# Altium project PCB_Project_Dangrangto.PrjPcb
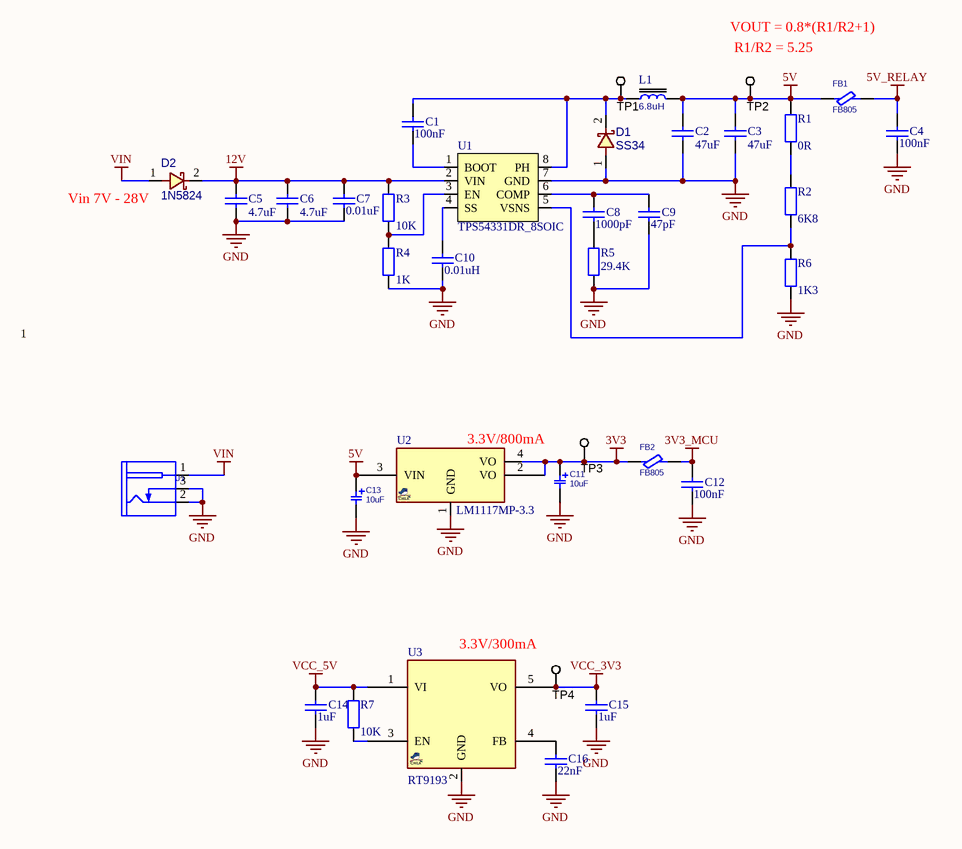
[diagram p0: Power.SchDoc]
5 sheets, 163 parts. Net scope: global (net labels, ports and power ports of the same name join across sheets).
Board file: PCB_Project_Dangrangto.PcbDoc
Sheets:
  Power.SchDoc
  MCU_ESP32_S3.SchDoc
  OUTPUT_RELAY.SchDoc
  SENSOR.SchDoc
  Protocol.SchDoc

## Sheet Power.SchDoc
size A4; SheetNumber: 1; SheetTotal: 5

### Parts
C1  Ma_Hang: 100nF  [tu 0603]  (hidden comment: 100nF_0603_1%)
C2  Ma_Hang: 47uF  [tu 1206]  (hidden comment: 47uF_1206_1%)
C3  Ma_Hang: 47uF  [tu 1206]  (hidden comment: 47uF_1206_1%)
C4  Ma_Hang: 100nF  [tu 0603]  (hidden comment: 100nF_0603_1%)
C5  Ma_Hang: 4.7uF  [tu 1206]  (hidden comment: 4.7uF_1206_1%)
C6  Ma_Hang: 4.7uF  [tu 1206]  (hidden comment: 4.7uF_1206_1%)
C7  Ma_Hang: 0.01uF  [tu 0603]  (hidden comment: 0.01uF_0603_1%)
C8  Ma_Hang: 1000pF  [tu 0603]  (hidden comment: 1000pF_0603_1%)
C9  Ma_Hang: 47pF  [tu 0603]  (hidden comment: 47pF_0603_1%)
C10  Ma_Hang: 0.01uH  [tu 0603]  (hidden comment: 0.01uF_0603_1%)
C11  value 10uF  [C_TN_3216]  (hidden comment: 10uF/6.3V)
C12  Ma_Hang: 100nF  [tu 0603]  (hidden comment: 100nF_0603_1%)
C13  value 10uF  [C_TN_3216]  (hidden comment: 10uF/10V)
C14  Ma_Hang: 1uF  [tu 0603]  (hidden comment: 1uF_0603_1%)
C15  Ma_Hang: 1uF  [tu 0603]  (hidden comment: 1uF_0603_1%)
C16  Ma_Hang: 22nF  [tu 0603]  (hidden comment: 22nF_0603_1%)
D1  value SS34  [D_SMB]  (hidden comment: SS34_SMA)
D2  value 1N5824  [D_SMA]  (hidden comment: SS54_SMA)
FB1  FB805  [L0805]
FB2  FB805  [L0805]
J1  DC_POWER_JACK  [JAC_PWR2]  (value not drawn)
L1  value 6.8uH  [L_10]  (hidden comment: 6.8uH_CD104)
R1  Ma_Hang: 0R  [tro smd 0603]  (hidden comment: 0R_0603_1%)
R2  Ma_Hang: 6K8  [tro smd 0603]  (hidden comment: 6K8_0603_1%)
R3  Ma_Hang: 10K  [tro smd 0603]  (hidden comment: 10K_0603_1%)
R4  Ma_Hang: 1K  [tro smd 0603]  (hidden comment: 1K_0603_1%)
R5  Ma_Hang: 29.4K  [tro smd 0805]  (hidden comment: 29.4K_0805_1%)
R6  Ma_Hang: 1K3  [tro smd 0603]  (hidden comment: 1K3_0603_1%)
R7  Ma_Hang: 10K  [tro smd 0603]  (hidden comment: 10K_0603_1%)
TP1  TESTPOINT_PROBE  [TEST_POINT_1.0X1.0MM]  (value not drawn)  (no BOM)
TP2  TESTPOINT_PROBE  [TEST_POINT_1.0X1.0MM]  (value not drawn)  (no BOM)
TP3  TESTPOINT_PROBE  [TEST_POINT_1.0X1.0MM]  (value not drawn)  (no BOM)
TP4  TESTPOINT_PROBE  [TEST_POINT_1.0X1.0MM]  (value not drawn)  (no BOM)
U1  TPS54331DR_8SOIC  [SOIC-8N]
U2  value LM1117MP-3.3  [SOT223_4]  (hidden comment: LM1117IMP-3.3/NOPB)
U3  RT9193  [SOT23_5]

### Nets
3V3: C11.1 FB2.1 TP3.1 U2.2(VO) U2.4(VO)
3V3_MCU: C12.1 FB2.2
5V: C2.1 C3.1 C13.1 FB1.1 L1.2 R1.2 TP2.1 U2.3(VIN)
5V_RELAY: C4.1 FB1.2
12V: C5.1 C6.1 C7.1 D2.2 R3.2 U1.2(VIN)
GND: C2.2 C3.2 C4.2 C5.2 C6.2 C7.2 C9.2 C10.2 C11.2 C12.2 C13.2 C14.2 C15.2 C16.2 D1.1 J1.2(SLEEVE) J1.3(INSERTION_DET) R4.1 R5.1 R6.1 U1.7(GND) U2.1(GND) U3.2(GND)
VCC_3V3: C15.1 TP4.1 U3.5(VO)
VCC_5V: C14.1 R7.2 U3.1(VI)
VIN: D2.1 J1.1(TIP)
NetC1_1: C1.1 D1.2 L1.1 TP1.1 U1.8(PH)
NetC1_2: C1.2 U1.1(BOOT)
NetC8_1: C8.1 C9.1 U1.6(COMP)
NetC8_2: C8.2 R5.2
NetC10_1: C10.1 U1.4(SS)
NetC16_1: C16.1 U3.4(FB)
NetR1_1: R1.1 R2.2
NetR2_1: R2.1 R6.2 U1.5(VSNS)
NetR3_1: R3.1 R4.2 U1.3(EN)
NetR7_1: R7.1 U3.3(EN)

### Notes on the sheet
- VOUT = 0.8*(R1/R2+1)
- R1/R2 = 5.25
- (near D2) Vin 7V - 28V
- 1
- (near U2) 3.3V/800mA
- 3.3V/300mA

### Library data of the parts
C1 C4 C7-C9 C12 C14-C16 = Tu 0603 470pF 50V 10%: Capacitor, Ceramic, 50V; Chung_Loai: Dán; Don_Vi: Con; So_Chan: 2; Ten_Linh_Kien: Tụ 0603 470P 50V 10%; Kieu_Chan: *
C2 C3 C5 C6 = Tu 1206 103 50V 10%: Capacitor, Ceramic, 50V; Chung_Loai: Dán; Don_Vi: Con; So_Chan: 2; Ten_Linh_Kien: Tụ 1206 103-10nF 10% 50V; Kieu_Chan: *
C10 = Tu 0603 470pF 50V 10%: CAP SMD 0603; Chung_Loai: Dán; Don_Vi: Con; So_Chan: 2; Ten_Linh_Kien: Tụ 0603 470P 50V 10%; Kieu_Chan: *
C11 = CAP_SMD_TAN_10uF_6.3V: CAP, SMD, TAN; PARAM: 20%, 300mOhm, -55~105oC; MANF: VISHAY; MANF_P#: T55A106M6R3C0300; PARAM2: 6.3V; PRICE: 0.46$
C13 = CAP_SMD_TAN_10uF_10V: CAP, SMD, TAN; PARAM: 20%, 300mOhm, -55~105oC; MANF: VISHAY; MANF_P#: T55A106M010C0300; PARAM2: 10V; PRICE: 0.46$
D1 = DIODE_SMD_SCHOTTKY_SS34: DIODE, SCHOTTKY, 20V, 3A; MANF: VISHAY; DESC: DESCRIPTION; MANF_P#: SS34; ASSEMBLY: ASSEMBLY; PRICE: PRICE; PARAM2: 3A; PARAM: 20V
D2 = DIODE_SMD_SCHOTTKY_1N5822: DIODE, SCHOTTKY, 40V, 3A; MANF: DIODES; MANF_P#: 1N5822; DESC: DESCRIPTION; ASSEMBLY: ASSEMBLY; PRICE: PRICE; PARAM2: 3A; PARAM: 40V
FB1 FB2 = FBEAD_SMD_BLM21PG221: FERRITE_Bead, 0805, 2A, 50mOhm, 220@100MHz; MANF: MURATA; MANF_P#: BLM15AG121SN1D; PARAM: 220@100MHz; PARAM2: 2A, 50mOhm; VALUE: FB805
J1 = CONN_PWR_JACKR2: CONN, PWR JACK DC, PLUG DIAM 2.0MM RA THD; MANF: CUI STACK; MANF_P#: PJ-202A, PJ-002AH, PJ-102AH, KLDX-0202; VALUE: DC_POWER_JACK
L1 = INDPWR_SMD: INDUCTOR, POWER, SMD
R1-R4 R6 R7 = Tro 0603 5% 10k: RES SMD 0603; Chung_Loai: Dán; Don_Vi: Con; So_Chan: 2; Ten_Linh_Kien: Trở 0603 5% 10k; Kieu_Chan: *
R5 = Tro 0805 1% 5.1k: Dán; Don_Vi: Con; So_Chan: 2; Ten_Linh_Kien: Trở 0805 1% 5.1k; Chung_Loai: Dán; Kieu_Chan: *
TP1-TP4 = TESTPOINT_PROBE: TEST POINT; MANF: MANF; MANF_P#: MANF_P#; VALUE: VALUE
U1 = TPS54331DR: IC REG BUCK ADJ 3A 8SOIC
U2 = VREG_1117_SOT223: REG, Linear, LDO1V, 0.8A, SOT-223; MANF_P#: LD1117, LM1117, AMS1117, TLV1117, REG1117, NCP1117, LT1117, SPX1117; MANF: TI, ON, ST; PARAM2: 1.2/1.5/1.8/2.5/2.85/3.3/5V; PARAM: LDO1V, 0.8A
U3 = VREG_LDO_SOT23_5: REG, Linear, LDO, SOT-23-5; MANF_P#: AS1353, MIC5504YM5, MCP1824T-3302E/OT, ADP122AUJZ, TLV70233DBVR, LDK130M33R, NCP603SN, AP2210K, AP7331, AP2125K, RP114N; MANF: -; VALUE: RT9193

## Sheet MCU_ESP32_S3.SchDoc
size A4; SheetNumber: 2; SheetTotal: 5
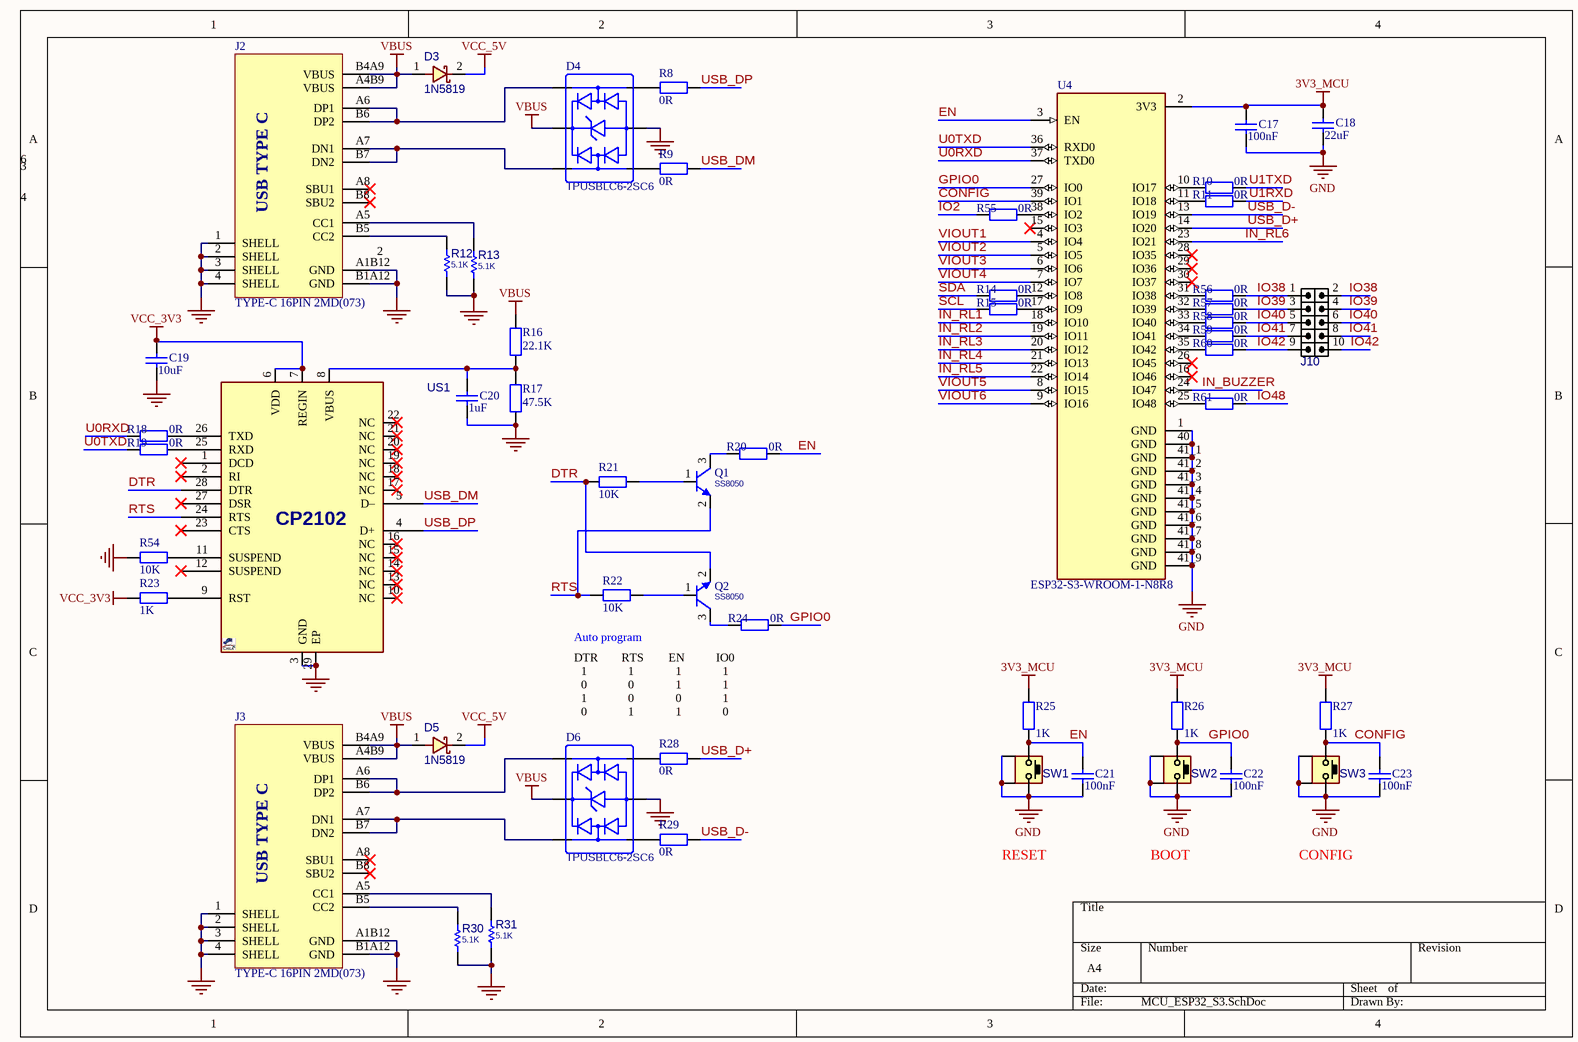
[diagram p1: MCU_ESP32_S3.SchDoc]

### Parts
C17  Ma_Hang: 100nF  [tu 0603]  (hidden comment: 100nF_0603_1%)
C18  Ma_Hang: 22uF  [tu 0603]  (hidden comment: 22uF_0603_1%)
C19  Ma_Hang: 10uF  [tu 0603]  (hidden comment: 10uF_0603_1%)
C20  Ma_Hang: 1uF  [tu 0603]  (hidden comment: 1uF_0603_1%)
C21  Ma_Hang: 100nF  [tu 0603]  (hidden comment: 100nF_0603_1%)
C22  Ma_Hang: 100nF  [tu 0603]  (hidden comment: 100nF_0603_1%)
C23  Ma_Hang: 100nF  [tu 0603]  (hidden comment: 100nF_0603_1%)
D3  value 1N5819  [D_SOD123W]  (hidden comment: 1N5819_DO213)
D4  TPUSBLC6-2SC6  [SOT-23-6_L2.9-W1.6-P0.95-LS2.8-BR]
D5  value 1N5819  [D_SOD123W]  (hidden comment: 1N5819_DO213)
D6  TPUSBLC6-2SC6  [SOT-23-6_L2.9-W1.6-P0.95-LS2.8-BR]
J2  TYPE-C 16PIN 2MD(073)  [USB-C-SMD_TYPE-C16PIN]
J3  TYPE-C 16PIN 2MD(073)  [USB-C-SMD_TYPE-C16PIN]
J10  HDRMINI_2X5  [HDRMINI_M_2X5]  (value not drawn)
Q1  SS8050  [SOT23_3]
Q2  SS8050  [SOT23_3]
R8  Ma_Hang: 0R  [tro smd 0603]  (hidden comment: 0R_0603_1%)
R9  Ma_Hang: 0R  [tro smd 0603]  (hidden comment: 0R_0603_1%)
R10  Ma_Hang: 0R  [tro smd 0603]  (hidden comment: 0R_0603_1%)
R11  Ma_Hang: 0R  [tro smd 0603]  (hidden comment: 0R_0603_1%)
R12  value 5.1K  [R0603]  (hidden comment: 5K1_0603_1%)
R13  value 5.1K  [R0603]  (hidden comment: 5K1_0603_1%)
R14  Ma_Hang: 0R  [tro smd 0603]  (hidden comment: 0R_0603_1%)
R15  Ma_Hang: 0R  [tro smd 0603]  (hidden comment: 0R_0603_1%)
R16  Ma_Hang: 22.1K  [tro smd 0603]  (hidden comment: 22.1K_0603_1%)
R17  Ma_Hang: 47.5K  [tro smd 0603]  (hidden comment: 47.5K_0603_1%)
R18  Ma_Hang: 0R  [tro smd 0603]  (hidden comment: 0R_0603_1%)
R19  Ma_Hang: 0R  [tro smd 0603]  (hidden comment: 0R_0603_1%)
R20  Ma_Hang: 0R  [tro smd 0603]  (hidden comment: 0R_0603_1%)
R21  Ma_Hang: 10K  [tro smd 0603]  (hidden comment: 10K_0603_1%)
R22  Ma_Hang: 10K  [tro smd 0603]  (hidden comment: 10K_0603_1%)
R23  Ma_Hang: 1K  [tro smd 0603]  (hidden comment: 1K_0603_1%)
R24  Ma_Hang: 0R  [tro smd 0603]  (hidden comment: 0R_0603_1%)
R25  Ma_Hang: 1K  [tro smd 0603]  (hidden comment: 1K_0603_1%)
R26  Ma_Hang: 1K  [tro smd 0603]  (hidden comment: 1K_0603_1%)
R27  Ma_Hang: 1K  [tro smd 0603]  (hidden comment: 1K_0603_1%)
R28  Ma_Hang: 0R  [tro smd 0603]  (hidden comment: 0R_0603_1%)
R29  Ma_Hang: 0R  [tro smd 0603]  (hidden comment: 0R_0603_1%)
R30  value 5.1K  [R0603]  (hidden comment: 5K1_0603_1%)
R31  value 5.1K  [R0603]  (hidden comment: 5K1_0603_1%)
R54  Ma_Hang: 10K  [tro smd 0603]  (hidden comment: 10K_0603_1%)
R55  Ma_Hang: 0R  [tro smd 0603]  (hidden comment: 0R_0603_1%)
R56  Ma_Hang: 0R  [tro smd 0603]  (hidden comment: 0R_0603_1%)
R57  Ma_Hang: 0R  [tro smd 0603]  (hidden comment: 0R_0603_1%)
R58  Ma_Hang: 0R  [tro smd 0603]  (hidden comment: 0R_0603_1%)
R59  Ma_Hang: 0R  [tro smd 0603]  (hidden comment: 0R_0603_1%)
R60  Ma_Hang: 0R  [tro smd 0603]  (hidden comment: 0R_0603_1%)
R61  Ma_Hang: 0R  [tro smd 0603]  (hidden comment: 0R_0603_1%)
SW1  PUSHBUTTON  [SWPBT_SPST_R_6X6X10]  (value not drawn)
SW2  PUSHBUTTON  [SWPBT_SPST_R_6X6X10]  (value not drawn)
SW3  PUSHBUTTON  [SWPBT_SPST_R_6X6X10]  (value not drawn)
U4  ESP32-S3-WROOM-1-N8R8  [XCVR_ESP32S3WROOM1N8R8]
US1  CP2102_QFN28  [QFN50_28T]  (value not drawn)

### Nets
3V3_MCU: C17.1 C18.1 R25.2 R26.2 R27.2 U4.2(3V3)
GND: C17.2 C18.2 C19.2 C20.2 C21.2 C22.2 C23.2 D4.2(GND) D6.2(GND) J2.1(SHELL) J2.2(SHELL) J2.3(SHELL) J2.4(SHELL) J2.A1B12(GND) J2.B1A12(GND) J3.1(SHELL) J3.2(SHELL) J3.3(SHELL) J3.4(SHELL) J3.A1B12(GND) J3.B1A12(GND) R12.2 R13.2 R17.2 R30.2 R31.2 R54.2 SW1.2 SW1.MH1 SW1.MH2 SW2.2 SW2.MH1 SW2.MH2 SW3.2 SW3.MH1 SW3.MH2 U4.1(GND) U4.40(GND) U4.41_1(GND) U4.41_2(GND) U4.41_3(GND) U4.41_4(GND) U4.41_5(GND) U4.41_6(GND) U4.41_7(GND) U4.41_8(GND) U4.41_9(GND) US1.3(GND) US1.29(EP)
VBUS: D3.1 D4.5(VBUS) D5.1 D6.5(VBUS) J2.A4B9(VBUS) J2.B4A9(VBUS) J3.A4B9(VBUS) J3.B4A9(VBUS) R16.1
VCC_3V3: C19.1 R23.1 US1.6(VDD) US1.7(REGIN)
VCC_5V: D3.2 D5.2
CONFIG: C23.1 R27.1 SW3.1 U4.39(IO1)
DTR: Q2.2(E) R21.2 US1.28(DTR)
EN: C21.1 R20.2 R25.1 SW1.1 U4.3(EN)
GPIO0: C22.1 R24.2 R26.1 SW2.1 U4.27(IO0)
IN_BUZZER: U4.24(IO47)
IN_RL1: U4.18(IO10)
IN_RL2: U4.19(IO11)
IN_RL3: U4.20(IO12)
IN_RL4: U4.21(IO13)
IN_RL5: U4.22(IO14)
IN_RL6: U4.23(IO21)
IO2: R55.1
IO38: J10.1 J10.2 R56.2
IO39: J10.3 J10.4 R57.2
IO40: J10.5 J10.6 R58.2
IO41: J10.7 J10.8 R59.2
IO42: J10.9 J10.10 R60.2
IO48: R61.2
RTS: Q1.2(E) R22.2 US1.24(RTS)
SCL: R15.1
SDA: R14.1
U0RXD: R18.1 U4.37(TXD0)
U0TXD: R19.1 U4.36(RXD0)
U1RXD: R11.2
U1TXD: R10.2
USB_D+: R28.2 U4.14(IO20)
USB_D-: R29.2 U4.13(IO19)
USB_DM: R9.2 US1.5(D–)
USB_DP: R8.2 US1.4(D+)
VIOUT1: U4.4(IO4)
VIOUT2: U4.5(IO5)
VIOUT3: U4.6(IO6)
VIOUT4: U4.7(IO7)
VIOUT5: U4.8(IO15)
VIOUT6: U4.9(IO16)
NetC20_1: C20.1 R16.2 R17.1 US1.8(VBUS)
NetD4_1: D4.1(I/O1) R8.1
NetD4_3: D4.3(I/O2) R9.1
NetD4_4: D4.4(I/O2) J2.A7(DN1) J2.B7(DN2)
NetD4_6: D4.6(I/O1) J2.A6(DP1) J2.B6(DP2)
NetD6_1: D6.1(I/O1) R28.1
NetD6_3: D6.3(I/O2) R29.1
NetD6_4: D6.4(I/O2) J3.A7(DN1) J3.B7(DN2)
NetD6_6: D6.6(I/O1) J3.A6(DP1) J3.B6(DP2)
NetJ2_A5: J2.A5(CC1) R13.1
NetJ2_B5: J2.B5(CC2) R12.1
NetJ3_A5: J3.A5(CC1) R31.1
NetJ3_B5: J3.B5(CC2) R30.1
NetQ1_1: Q1.1(B) R21.1
NetQ1_3: Q1.3(C) R20.1
NetQ2_1: Q2.1(B) R22.1
NetQ2_3: Q2.3(C) R24.1
NetR10_1: R10.1 U4.10(IO17)
NetR11_1: R11.1 U4.11(IO18)
NetR14_2: R14.2 U4.12(IO8)
NetR15_2: R15.2 U4.17(IO9)
NetR18_2: R18.2 US1.26(TXD)
NetR19_2: R19.2 US1.25(RXD)
NetR23_2: R23.2 US1.9(RST)
NetR54_1: R54.1 US1.11(SUSPEND)
NetR55_2: R55.2 U4.38(IO2)
NetR56_1: R56.1 U4.31(IO38)
NetR57_1: R57.1 U4.32(IO39)
NetR58_1: R58.1 U4.33(IO40)
NetR59_1: R59.1 U4.34(IO41)
NetR60_1: R60.1 U4.35(IO42)
NetR61_1: R61.1 U4.25(IO48)

Not connected (* = marked no-connect by the designer): J2 A8(SBU1)* B8(SBU2)*; J3 A8(SBU1)* B8(SBU2)*; U4 15(IO3)* 16(IO46)* 26(IO45)* 28(IO35)* 29(IO36)* 30(IO37)*; US1 1(DCD)* 2(RI)* 10(NC)* 12(SUSPEND)* 13(NC)* 14(NC)* 15(NC)* 16(NC)* 17(NC)* 18(NC)* 19(NC)* 20(NC)* 21(NC)* 22(NC)* 23(CTS)* 27(DSR)*

### Notes on the sheet
- 3
- 6
- 4
- (near J2) 2
- Auto program
- DTR
- RTS
- EN
- IO0
- 1
- 0
- (near D6) 1
- (near D6) 0
- RESET
- BOOT
- CONFIG
- (in symbol TYPE-C 16PIN 2MD(073)) USB TYPE C

### Library data of the parts
C17-C23 = Tu 0603 470pF 50V 10%: as C1 on sheet Power; Kieu_Chan: *
D3 D5 = DIODE_SMD_SCHOTTKY_1N5819: DIODE, SCHOTTKY, 40V, 1A; MANF: DIODES; MANF_P#: 1N5819HW-7-F; DESC: DESCRIPTION; ASSEMBLY: ASSEMBLY; PRICE: PRICE; PARAM2: 1A; PARAM: 40V
D4 D6 = ESD_TPUSBLC6-2SC6: ESD ROHS SOT23-6 DIODES; Manufacturer: TECH PUBLIC; LCSC Part Number: C558442; Manufacturer Part Number: TPUSBLC6-2SC6; Package: SOT-23-6; Assembly Type: SMT Assembly
J2 J3 = TYPE-C 16PIN 2MD(073): 5A 1 Surface Mount 16 Female -25℃~+85℃ Type-C SMD USB Connectors ROHS; Manufacturer: SHOU HAN; Manufacturer Part Number: TYPE-C16PIN; LCSC Part Number: C2765186; Package: SMD; Assembly Type: SMT Assembly
J10 = HDRMINI_M_2X5: CONN, HEADER, Male, pitch: 1.27mm, 10POS; VALUE: HDRMINI_2X5
Q1 Q2 = NPN_MMBT8050_SOT23: BJT, NPN, 25v, 1.5A, SMD, SOT23; PARAM2: 300mW; MANF: GALAXY; PARAM: 25v, 1.5A; MANF_P#: MMBT8050; PRICE: 0.09t@JAVAN; VALUE: SS8050
R8-R11 R14-R29 R54-R61 = Tro 0603 5% 10k: as R1 on sheet Power; Kieu_Chan: *
R12 R13 R30 R31 = RES_SMD_0603: RESISTOR, SMD; PARAM: -W; DESC: DESCRIPTION; DIST#: MOUSER; PARAM2: 1%; MANF_P#: -; MANF: -; ASSEMBLY: ASSEMBLY; PRICE: 100= 0.5$
SW1-SW3 = SWPBT_SPST_R_6X6X10: SWITCH, PUSH BUTTON, TACTILE, THD, SPST, RIGHT; PARAM: 50mA/12VDC; DESC: DESCRIPTION; MANF: -; VALUE: PUSHBUTTON; ASSEMBLY: ASSEMBLY; PRICE: 0.3$; MANF_P#: -
U4 = ESP32-S3-WROOM-1-N8R8: Bluetooth, WiFi 802.11b/g/n, Bluetooth v5.0 Transceiver Module 2.4GHz PCB Trace Surface Mount; MF: Espressif Systems; Package: None; Price: None; Check_prices: https://www.snapeda.com/parts/ESP32-S3-WROOM-1-N8R8/Espressif+Systems/view-part/?ref=eda; Value: *; SnapEDA_Link: https://www.snapeda.com/parts/ESP32-S3-WROOM-1-N8R8/Espressif+Systems/view-part/?ref=snap; MP: ESP32-S3-WROOM-1-N8R8; Availability: In Stock; Purchase-URL: https://pricing.snapeda.com/search?q=ESP32-S3-WROOM-1-N8R8&ref=eda
US1 = CP2102_QFN28: USB-UART BRIDGE; MANF: SILICON LABS; DESC: DESCRIPTION; MANF_P#: CP2102; PARAM2: 3.3V; VALUE: CP2102; MANF: MANF; ASSEMBLY: ASSEMBLY; PRICE: PRICE

## Sheet OUTPUT_RELAY.SchDoc
size A4; SheetNumber: 3; SheetTotal: 5
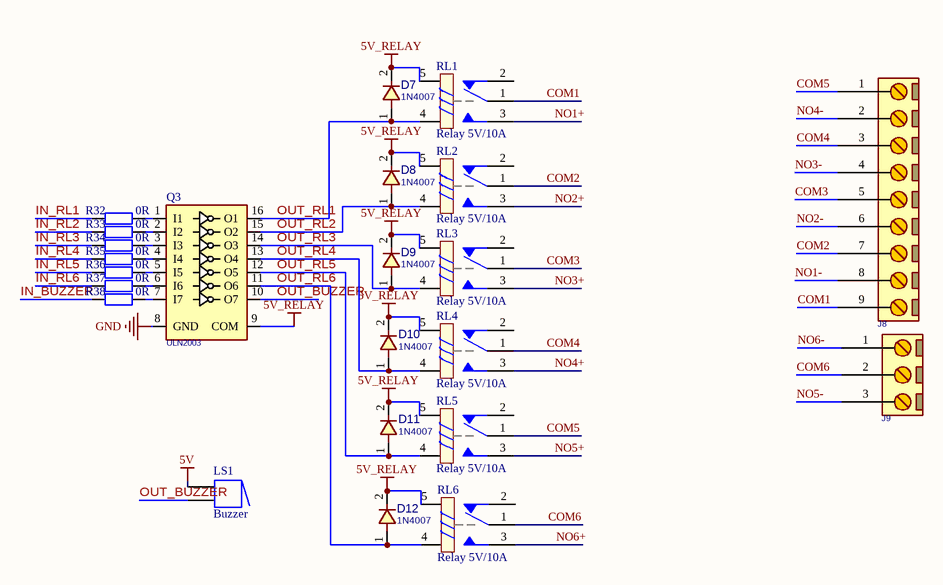
[diagram p2: OUTPUT_RELAY.SchDoc]

### Parts
D7  1N4007  [D_SMA]
D8  1N4007  [D_SMA]
D9  1N4007  [D_SMA]
D10  1N4007  [D_SMA]
D11  1N4007  [D_SMA]
D12  1N4007  [D_SMA]
J8  CONN_TB9  [TBB_9]  (value not drawn)
J9  CONN_TB3  [TBB_3]  (value not drawn)
LS1  Buzzer  [Buzzer]
Q3  value ULN2003  [SO_16_W]  (hidden comment: ULN2003_SOP16)
R32  Ma_Hang: 0R  [tro smd 0603]  (hidden comment: 0R_0603_1%)
R33  Ma_Hang: 0R  [tro smd 0603]  (hidden comment: 0R_0603_1%)
R34  Ma_Hang: 0R  [tro smd 0603]  (hidden comment: 0R_0603_1%)
R35  Ma_Hang: 0R  [tro smd 0603]  (hidden comment: 0R_0603_1%)
R36  Ma_Hang: 0R  [tro smd 0603]  (hidden comment: 0R_0603_1%)
R37  Ma_Hang: 0R  [tro smd 0603]  (hidden comment: 0R_0603_1%)
R38  Ma_Hang: 0R  [tro smd 0603]  (hidden comment: 0R_0603_1%)
RL1  Relay 5V/10A  [RL_10A_5V]
RL2  Relay 5V/10A  [RL_10A_5V]
RL3  Relay 5V/10A  [RL_10A_5V]
RL4  Relay 5V/10A  [RL_10A_5V]
RL5  Relay 5V/10A  [RL_10A_5V]
RL6  Relay 5V/10A  [RL_10A_5V]

### Nets
5V: LS1.1
5V_RELAY: D7.2 D8.2 D9.2 D10.2 D11.2 D12.2 Q3.9(COM) RL1.5 RL2.5 RL3.5 RL4.5 RL5.5 RL6.5
GND: Q3.8(GND)
COM1: J8.9 RL1.1
COM2: J8.7 RL2.1
COM3: J8.5 RL3.1
COM4: J8.3 RL4.1
COM5: J8.1 RL5.1
COM6: J9.2 RL6.1
IN_BUZZER: R38.2
IN_RL1: R32.2
IN_RL2: R33.2
IN_RL3: R34.2
IN_RL4: R35.2
IN_RL5: R36.2
IN_RL6: R37.2
NO1+: RL1.3
NO1-: J8.8
NO2+: RL2.3
NO2-: J8.6
NO3+: RL3.3
NO3-: J8.4
NO4+: RL4.3
NO4-: J8.2
NO5+: RL5.3
NO5-: J9.3
NO6+: RL6.3
NO6-: J9.1
OUT_BUZZER: LS1.2 Q3.10(O7)
OUT_RL1: D7.1 Q3.16(O1) RL1.4
OUT_RL2: D8.1 Q3.15(O2) RL2.4
OUT_RL3: D9.1 Q3.14(O3) RL3.4
OUT_RL4: D10.1 Q3.13(O4) RL4.4
OUT_RL5: D11.1 Q3.12(O5) RL5.4
OUT_RL6: D12.1 Q3.11(O6) RL6.4
NetQ3_1: Q3.1(I1) R32.1
NetQ3_2: Q3.2(I2) R33.1
NetQ3_3: Q3.3(I3) R34.1
NetQ3_4: Q3.4(I4) R35.1
NetQ3_5: Q3.5(I5) R36.1
NetQ3_6: Q3.6(I6) R37.1
NetQ3_7: Q3.7(I7) R38.1

Not connected (* = marked no-connect by the designer): RL1 2; RL2 2; RL3 2; RL4 2; RL5 2; RL6 2

### Library data of the parts
D7-D12 = DIODE_SMD_1N4007: DIODE, GENERAL PURPOSE, 1000V/1A; MANF: Kingtronics; DESC: DESCRIPTION; PARAM: 1000V VRRM; PARAM2: 1A; MANF_P#: M7; ASSEMBLY: ASSEMBLY; PRICE: PRICE; VALUE: 1N4007
J8 = CONN_TB9: CONN, TERMINAL BLOCK, 5.08mm pitch; VALUE: CONN_TB9
J9 = CONN_TB3: CONN, TERMINAL BLOCK, 5.08mm pitch; VALUE: CONN_TB3
LS1 = Buzzer: Magnetic Transducer Buzzer; Published: 24-Mar-1999; LatestRevisionDate: 17-Dec-2003; LatestRevisionNote: Schematic revised, PCB Footprint replaced.; DatasheetDocument: 17-Dec-2003; PackageReference: ABSM-1574; Publisher: Altium Limited; ComponentLink1Description: Manufacturer Link; ComponentLink1URL: http://www.megastar.com/linecard/buzzmode/index.php
Q3 = ULN2003_SOP16: Darlington, 7-CH, 50V, 0.5A; MANF_P#: ULN2003A; MANF: DIODES; PARAM: 7-CH, 50V, 0.5A; PARAM2: -
R32-R38 = Tro 0603 5% 10k: as R1 on sheet Power; Kieu_Chan: *
RL1-RL6 = Relay 5V10A: Relay SPDT,10A - 12VDC 5 Pin; Value: Relay SPDT, 10A, 12V

## Sheet SENSOR.SchDoc
size A4; SheetNumber: 4; SheetTotal: 5
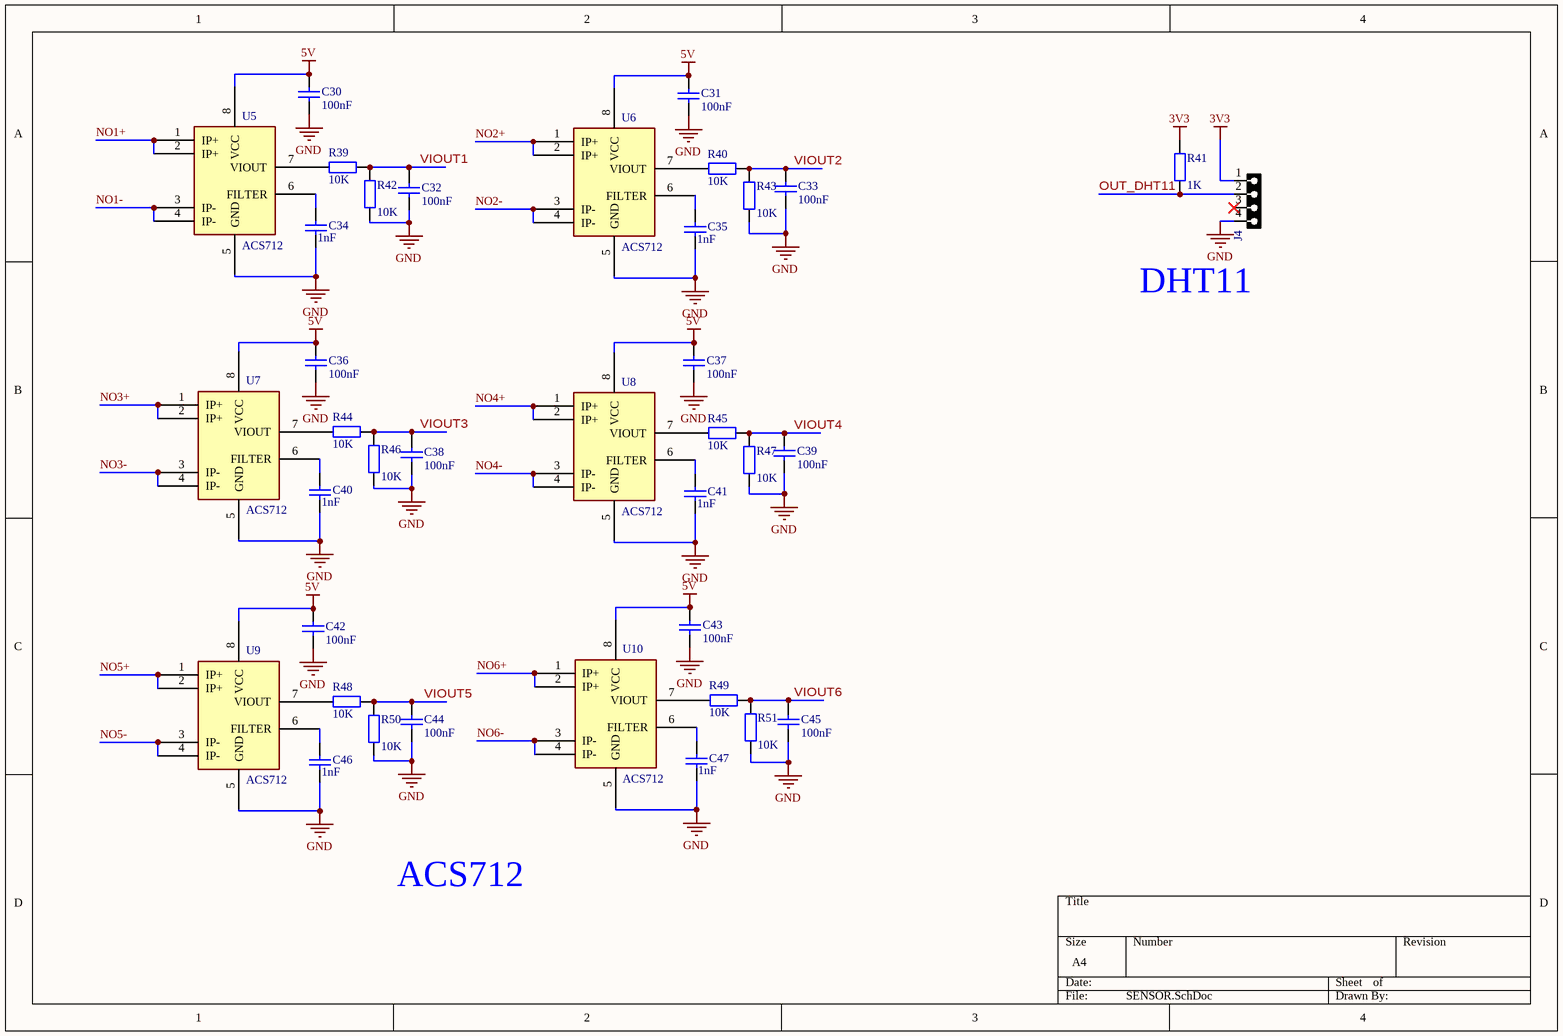
[diagram p3: SENSOR.SchDoc]

### Parts
C30  Ma_Hang: 100nF  [tu 0603]  (hidden comment: 100nF_0603_1%)
C31  Ma_Hang: 100nF  [tu 0603]  (hidden comment: 100nF_0603_1%)
C32  Ma_Hang: 100nF  [tu 0603]  (hidden comment: 100nF_0603_1%)
C33  Ma_Hang: 100nF  [tu 0603]  (hidden comment: 100nF_0603_1%)
C34  Ma_Hang: 1nF  [tu 0603]  (hidden comment: 1nF_0603_1%)
C35  Ma_Hang: 1nF  [tu 0603]  (hidden comment: 1nF_0603_1%)
C36  Ma_Hang: 100nF  [tu 0603]  (hidden comment: 100nF_0603_1%)
C37  Ma_Hang: 100nF  [tu 0603]  (hidden comment: 100nF_0603_1%)
C38  Ma_Hang: 100nF  [tu 0603]  (hidden comment: 100nF_0603_1%)
C39  Ma_Hang: 100nF  [tu 0603]  (hidden comment: 100nF_0603_1%)
C40  Ma_Hang: 1nF  [tu 0603]  (hidden comment: 1nF_0603_1%)
C41  Ma_Hang: 1nF  [tu 0603]  (hidden comment: 1nF_0603_1%)
C42  Ma_Hang: 100nF  [tu 0603]  (hidden comment: 100nF_0603_1%)
C43  Ma_Hang: 100nF  [tu 0603]  (hidden comment: 100nF_0603_1%)
C44  Ma_Hang: 100nF  [tu 0603]  (hidden comment: 100nF_0603_1%)
C45  Ma_Hang: 100nF  [tu 0603]  (hidden comment: 100nF_0603_1%)
C46  Ma_Hang: 1nF  [tu 0603]  (hidden comment: 1nF_0603_1%)
C47  Ma_Hang: 1nF  [tu 0603]  (hidden comment: 1nF_0603_1%)
J4  HDRF4  [HDR_F_1X4]  (value not drawn)
R39  Ma_Hang: 10K  [tro smd 0603]  (hidden comment: 10K_0603_1%)
R40  Ma_Hang: 10K  [tro smd 0603]  (hidden comment: 10K_0603_1%)
R41  Ma_Hang: 1K  [tro smd 0603]  (hidden comment: 1K_0603_1%)
R42  Ma_Hang: 10K  [tro smd 0603]  (hidden comment: 10K_0603_1%)
R43  Ma_Hang: 10K  [tro smd 0603]  (hidden comment: 10K_0603_1%)
R44  Ma_Hang: 10K  [tro smd 0603]  (hidden comment: 10K_0603_1%)
R45  Ma_Hang: 10K  [tro smd 0603]  (hidden comment: 10K_0603_1%)
R46  Ma_Hang: 10K  [tro smd 0603]  (hidden comment: 10K_0603_1%)
R47  Ma_Hang: 10K  [tro smd 0603]  (hidden comment: 10K_0603_1%)
R48  Ma_Hang: 10K  [tro smd 0603]  (hidden comment: 10K_0603_1%)
R49  Ma_Hang: 10K  [tro smd 0603]  (hidden comment: 10K_0603_1%)
R50  Ma_Hang: 10K  [tro smd 0603]  (hidden comment: 10K_0603_1%)
R51  Ma_Hang: 10K  [tro smd 0603]  (hidden comment: 10K_0603_1%)
U5  value ACS712  [SO_8]  (hidden comment: ACS712_8SOIC)
U6  value ACS712  [SO_8]  (hidden comment: ACS712_8SOIC)
U7  value ACS712  [SO_8]  (hidden comment: ACS712_8SOIC)
U8  value ACS712  [SO_8]  (hidden comment: ACS712_8SOIC)
U9  value ACS712  [SO_8]  (hidden comment: ACS712_8SOIC)
U10  value ACS712  [SO_8]  (hidden comment: ACS712_8SOIC)

### Nets
3V3: J4.1 R41.2
5V: C30.1 C31.1 C36.1 C37.1 C42.1 C43.1 U5.8(VCC) U6.8(VCC) U7.8(VCC) U8.8(VCC) U9.8(VCC) U10.8(VCC)
GND: C30.2 C31.2 C32.2 C33.2 C34.2 C35.2 C36.2 C37.2 C38.2 C39.2 C40.2 C41.2 C42.2 C43.2 C44.2 C45.2 C46.2 C47.2 J4.4 R42.1 R43.1 R46.1 R47.1 R50.1 R51.1 U5.5(GND) U6.5(GND) U7.5(GND) U8.5(GND) U9.5(GND) U10.5(GND)
NO1+: U5.1(IP+) U5.2(IP+)
NO1-: U5.3(IP-) U5.4(IP-)
NO2+: U6.1(IP+) U6.2(IP+)
NO2-: U6.3(IP-) U6.4(IP-)
NO3+: U7.1(IP+) U7.2(IP+)
NO3-: U7.3(IP-) U7.4(IP-)
NO4+: U8.1(IP+) U8.2(IP+)
NO4-: U8.3(IP-) U8.4(IP-)
NO5+: U9.1(IP+) U9.2(IP+)
NO5-: U9.3(IP-) U9.4(IP-)
NO6+: U10.1(IP+) U10.2(IP+)
NO6-: U10.3(IP-) U10.4(IP-)
OUT_DHT11: J4.2 R41.1
VIOUT1: C32.1 R39.1 R42.2
VIOUT2: C33.1 R40.1 R43.2
VIOUT3: C38.1 R44.1 R46.2
VIOUT4: C39.1 R45.1 R47.2
VIOUT5: C44.1 R48.1 R50.2
VIOUT6: C45.1 R49.1 R51.2
NetC34_1: C34.1 U5.6(FILTER)
NetC35_1: C35.1 U6.6(FILTER)
NetC40_1: C40.1 U7.6(FILTER)
NetC41_1: C41.1 U8.6(FILTER)
NetC46_1: C46.1 U9.6(FILTER)
NetC47_1: C47.1 U10.6(FILTER)
NetR39_2: R39.2 U5.7(VIOUT)
NetR40_2: R40.2 U6.7(VIOUT)
NetR44_2: R44.2 U7.7(VIOUT)
NetR45_2: R45.2 U8.7(VIOUT)
NetR48_2: R48.2 U9.7(VIOUT)
NetR49_2: R49.2 U10.7(VIOUT)

Not connected (* = marked no-connect by the designer): J4 3*

### Notes on the sheet
- (near J4) DHT11
- ACS712

### Library data of the parts
C30-C47 = Tu 0603 470pF 50V 10%: as C1 on sheet Power; Kieu_Chan: *
J4 = HDR_F_1X4: CONN, HEADER, Female, pitch: 2.54mm, 4POS; VALUE: HDRF4
R39-R51 = Tro 0603 5% 10k: as R1 on sheet Power; Kieu_Chan: *
U5-U10 = ACS712: IC, CURRENT SENSOR, HALL EFFECT; MANF: Allegro; PARAM2: 5Vcc, 80KHz BW; PARAM: 66~185mV/A, 20/30A max, -40~85oC; MANF_P#: ACS712

## Sheet Protocol.SchDoc
size A4; SheetNumber: 5; SheetTotal: 5
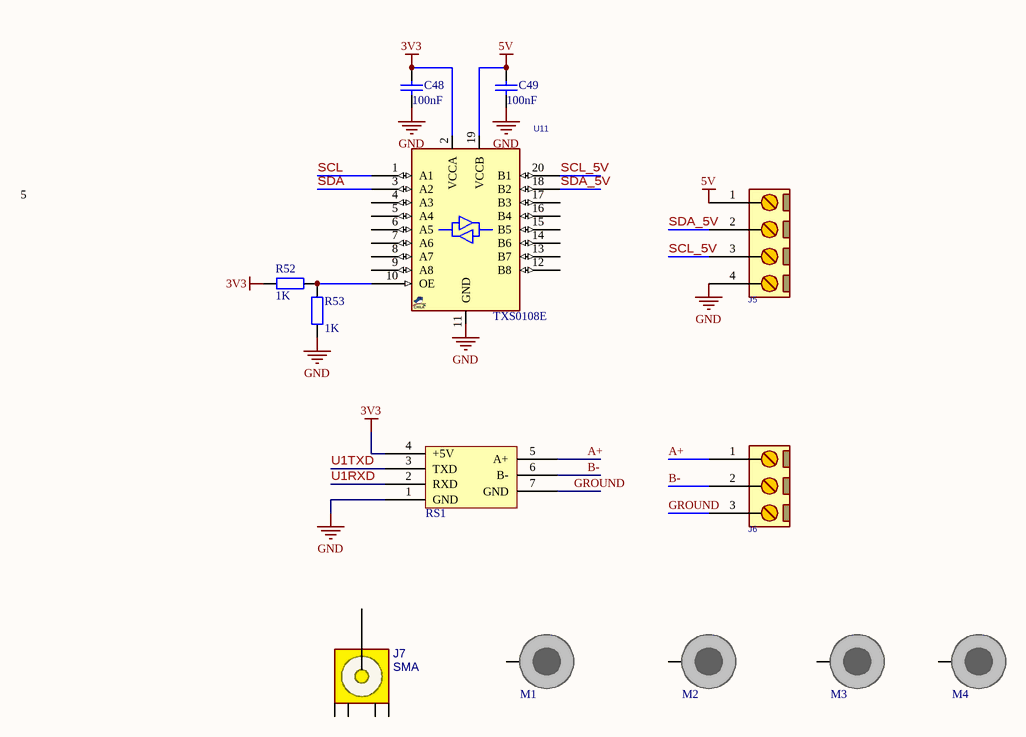
[diagram p4: Protocol.SchDoc]

### Parts
C48  Ma_Hang: 100nF  [tu 0603]  (hidden comment: 100nF_0603_1%)
C49  Ma_Hang: 100nF  [tu 0603]  (hidden comment: 100nF_0603_1%)
J5  CONN_TB4  [TBB_4]  (value not drawn)
J6  CONN_TB3  [TBB_3]  (value not drawn)
J7  SMA  [SMA_RA]
M1  DNP/MH  [SCMH_M3FT]  (value not drawn)  (no BOM)
M2  DNP/MH  [SCMH_M3FT]  (value not drawn)  (no BOM)
M3  DNP/MH  [SCMH_M3FT]  (value not drawn)  (no BOM)
M4  DNP/MH  [SCMH_M3FT]  (value not drawn)  (no BOM)
R52  Ma_Hang: 1K  [tro smd 0603]  (hidden comment: 1K_0603_1%)
R53  Ma_Hang: 1K  [tro smd 0603]  (hidden comment: 1K_0603_1%)
RS1  RS485_VISION2  [RS485 - Version2]  (value not drawn)
U11  TXS0108E  [SOG65_20]

### Nets
3V3: C48.1 R52.2 RS1.4(+5V) U11.2(VCCA)
5V: C49.1 J5.1 U11.19(VCCB)
GND: C48.2 C49.2 J5.4 R53.1 RS1.1(GND) U11.11(GND)
A+: J6.1 RS1.5(A+)
B-: J6.2 RS1.6(B-)
GROUND: J6.3 RS1.7(GND)
SCL: U11.1(A1)
SCL_5V: J5.3 U11.20(B1)
SDA: U11.3(A2)
SDA_5V: J5.2 U11.18(B2)
U1RXD: RS1.2(RXD)
U1TXD: RS1.3(TXD)
NetR52_1: R52.1 R53.2 U11.10(OE)

Not connected (* = marked no-connect by the designer): J7 1(SIG) 2(G1) 3(G2) 4(G3) 5(G4); M1 1; M2 1; M3 1; M4 1; U11 4(A3) 5(A4) 6(A5) 7(A6) 8(A7) 9(A8) 12(B8) 13(B7) 14(B6) 15(B5) 16(B4) 17(B3)

### Notes on the sheet
- 5

### Library data of the parts
C48 C49 = Tu 0603 470pF 50V 10%: as C1 on sheet Power; Kieu_Chan: *
J5 = CONN_TB4: CONN, TERMINAL BLOCK, 5.08mm pitch; VALUE: CONN_TB4
J6 = CONN_TB3: CONN, TERMINAL BLOCK, 5.08mm pitch; VALUE: CONN_TB3
J7 = CONN_RF_SMA_RA: CONN, RF, SMA, Right Angle; MANF_P#: SMA-J-P-H-RA-TH1; MANF: Samtec; PARAM: 50Ohm, 20GHz; DESC: DESCRIPTION; DIST#: DIGIKEY; PARAM2: GOLD; ASSEMBLY: ASSEMBLY; PRICE: 6.3$; VALUE: SMA
M1-M4 = SCMH_M3FT: SCREW mouting, M3, 3.0mm diameter and 6.0mm, FlatHead; ASSEMBLY: DNP; VALUE: DNP/MH
R52 R53 = Tro 0603 5% 10k: as R1 on sheet Power; Kieu_Chan: *
U11 = TXS0108_SSOP20: Level Translator, Octal; MANF: Texas Instruments; MANF_P#: TXS0108EPWR; VALUE: TXS0108E

## Nets that join several sheets
3V3: Power (5 pins), SENSOR (J4.1 R41.2), Protocol (C48.1 R52.2 RS1.4 U11.2)
3V3_MCU: Power (C12.1 FB2.2), MCU_ESP32_S3 (6 pins)
5V: Power (8 pins), OUTPUT_RELAY (LS1.1), SENSOR (12 pins), Protocol (C49.1 J5.1 U11.19)
5V_RELAY: Power (C4.1 FB1.2), OUTPUT_RELAY (13 pins)
GND: Power (23 pins), MCU_ESP32_S3 (49 pins), OUTPUT_RELAY (Q3.8), SENSOR (31 pins), Protocol (6 pins)
VCC_3V3: Power (C15.1 TP4.1 U3.5), MCU_ESP32_S3 (C19.1 R23.1 US1.6 US1.7)
VCC_5V: Power (C14.1 R7.2 U3.1), MCU_ESP32_S3 (D3.2 D5.2)
IN_BUZZER: MCU_ESP32_S3 (U4.24), OUTPUT_RELAY (R38.2)
IN_RL1: MCU_ESP32_S3 (U4.18), OUTPUT_RELAY (R32.2)
IN_RL2: MCU_ESP32_S3 (U4.19), OUTPUT_RELAY (R33.2)
IN_RL3: MCU_ESP32_S3 (U4.20), OUTPUT_RELAY (R34.2)
IN_RL4: MCU_ESP32_S3 (U4.21), OUTPUT_RELAY (R35.2)
IN_RL5: MCU_ESP32_S3 (U4.22), OUTPUT_RELAY (R36.2)
IN_RL6: MCU_ESP32_S3 (U4.23), OUTPUT_RELAY (R37.2)
NO1+: OUTPUT_RELAY (RL1.3), SENSOR (U5.1 U5.2)
NO1-: OUTPUT_RELAY (J8.8), SENSOR (U5.3 U5.4)
NO2+: OUTPUT_RELAY (RL2.3), SENSOR (U6.1 U6.2)
NO2-: OUTPUT_RELAY (J8.6), SENSOR (U6.3 U6.4)
NO3+: OUTPUT_RELAY (RL3.3), SENSOR (U7.1 U7.2)
NO3-: OUTPUT_RELAY (J8.4), SENSOR (U7.3 U7.4)
NO4+: OUTPUT_RELAY (RL4.3), SENSOR (U8.1 U8.2)
NO4-: OUTPUT_RELAY (J8.2), SENSOR (U8.3 U8.4)
NO5+: OUTPUT_RELAY (RL5.3), SENSOR (U9.1 U9.2)
NO5-: OUTPUT_RELAY (J9.3), SENSOR (U9.3 U9.4)
NO6+: OUTPUT_RELAY (RL6.3), SENSOR (U10.1 U10.2)
NO6-: OUTPUT_RELAY (J9.1), SENSOR (U10.3 U10.4)
SCL: MCU_ESP32_S3 (R15.1), Protocol (U11.1)
SDA: MCU_ESP32_S3 (R14.1), Protocol (U11.3)
U1RXD: MCU_ESP32_S3 (R11.2), Protocol (RS1.2)
U1TXD: MCU_ESP32_S3 (R10.2), Protocol (RS1.3)
VIOUT1: MCU_ESP32_S3 (U4.4), SENSOR (C32.1 R39.1 R42.2)
VIOUT2: MCU_ESP32_S3 (U4.5), SENSOR (C33.1 R40.1 R43.2)
VIOUT3: MCU_ESP32_S3 (U4.6), SENSOR (C38.1 R44.1 R46.2)
VIOUT4: MCU_ESP32_S3 (U4.7), SENSOR (C39.1 R45.1 R47.2)
VIOUT5: MCU_ESP32_S3 (U4.8), SENSOR (C44.1 R48.1 R50.2)
VIOUT6: MCU_ESP32_S3 (U4.9), SENSOR (C45.1 R49.1 R51.2)